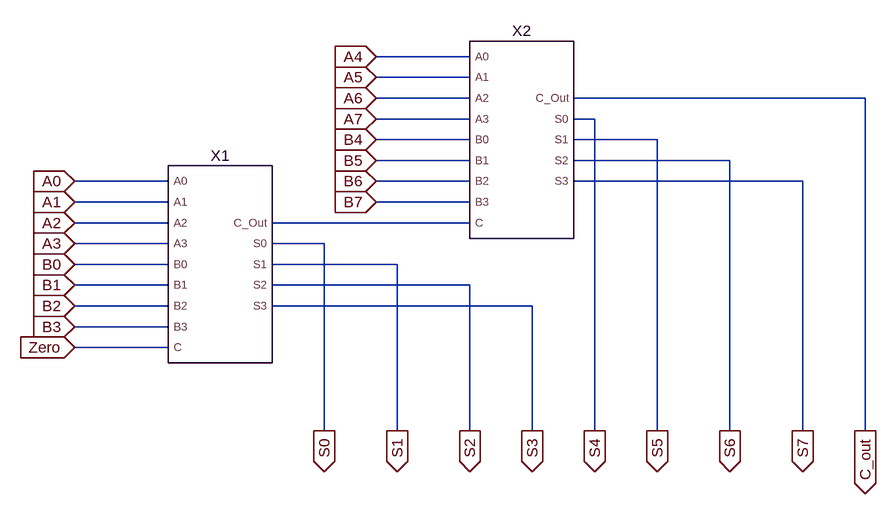
[diagram p0: schematic 8-bit_Adder.asc]
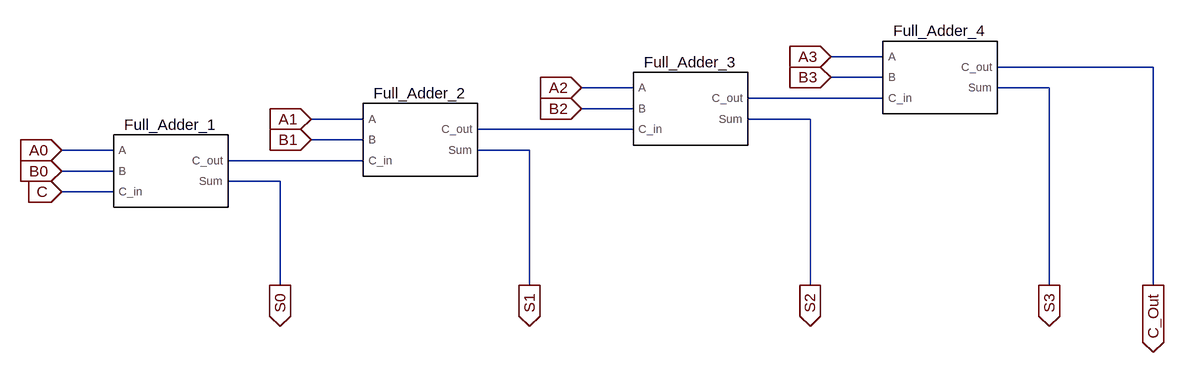
[diagram p1: sub-circuit 4-bit_adder.asc]
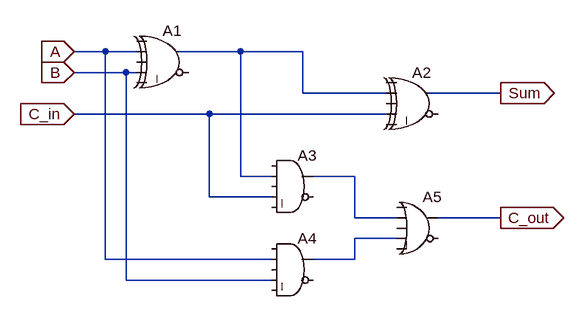
[diagram p2: sub-circuit full_adder.asc]
8-bit_Adder.asc, the LTspice schematic file:
Version 4
SHEET 1 880 720
WIRE 128 16 -16 16
WIRE 128 48 -16 48
WIRE 128 80 -16 80
WIRE 736 80 288 80
WIRE 128 112 -16 112
WIRE 320 112 288 112
WIRE 128 144 -16 144
WIRE 416 144 288 144
WIRE 128 176 -16 176
WIRE 528 176 288 176
WIRE -336 208 -480 208
WIRE 128 208 -16 208
WIRE 640 208 288 208
WIRE -336 240 -480 240
WIRE 128 240 -16 240
WIRE -336 272 -480 272
WIRE 128 272 -176 272
WIRE -336 304 -480 304
WIRE -96 304 -176 304
WIRE -336 336 -480 336
WIRE 16 336 -176 336
WIRE -336 368 -480 368
WIRE 128 368 -176 368
WIRE -336 400 -480 400
WIRE 224 400 -176 400
WIRE -336 432 -480 432
WIRE -336 464 -480 464
WIRE -96 592 -96 304
WIRE 16 592 16 336
WIRE 128 592 128 368
WIRE 224 592 224 400
WIRE 320 592 320 112
WIRE 416 592 416 144
WIRE 528 592 528 176
WIRE 640 592 640 208
WIRE 736 592 736 80
FLAG -480 208 A0
IOPIN -480 208 In
FLAG -480 240 A1
IOPIN -480 240 In
FLAG -480 272 A2
IOPIN -480 272 In
FLAG -480 304 A3
IOPIN -480 304 In
FLAG -16 16 A4
IOPIN -16 16 In
FLAG -16 48 A5
IOPIN -16 48 In
FLAG -16 80 A6
IOPIN -16 80 In
FLAG -16 112 A7
IOPIN -16 112 In
FLAG -16 144 B4
IOPIN -16 144 In
FLAG -16 176 B5
IOPIN -16 176 In
FLAG -16 208 B6
IOPIN -16 208 In
FLAG -16 240 B7
IOPIN -16 240 In
FLAG -480 336 B0
IOPIN -480 336 In
FLAG -480 368 B1
IOPIN -480 368 In
FLAG -480 400 B2
IOPIN -480 400 In
FLAG -480 432 B3
IOPIN -480 432 In
FLAG -480 464 Zero
IOPIN -480 464 In
FLAG -96 592 S0
IOPIN -96 592 Out
FLAG 16 592 S1
IOPIN 16 592 Out
FLAG 128 592 S2
IOPIN 128 592 Out
FLAG 224 592 S3
IOPIN 224 592 Out
FLAG 320 592 S4
IOPIN 320 592 Out
FLAG 416 592 S5
IOPIN 416 592 Out
FLAG 528 592 S6
IOPIN 528 592 Out
FLAG 640 592 S7
IOPIN 640 592 Out
FLAG 736 592 C_out
IOPIN 736 592 Out
SYMBOL 4-bit_Adder 176 144 R0
SYMATTR InstName X2
SYMBOL 4-bit_Adder -288 336 R0
SYMATTR InstName X1

4-bit_adder.asc, the sub-circuit schematic file:
Version 4
SHEET 1 1200 1108
WIRE 672 160 592 160
WIRE 1088 176 848 176
WIRE 672 192 592 192
WIRE 288 208 208 208
WIRE 928 208 848 208
WIRE 672 224 464 224
WIRE 288 240 208 240
WIRE -128 256 -208 256
WIRE 560 256 464 256
WIRE 288 272 48 272
WIRE -128 288 -208 288
WIRE -512 304 -592 304
WIRE 128 304 48 304
WIRE -128 320 -336 320
WIRE -512 336 -592 336
WIRE -256 352 -336 352
WIRE -512 368 -592 368
WIRE -256 512 -256 352
WIRE 128 512 128 304
WIRE 560 512 560 256
WIRE 928 512 928 208
WIRE 1088 512 1088 176
FLAG -592 304 A0
IOPIN -592 304 In
FLAG -208 256 A1
IOPIN -208 256 In
FLAG 208 208 A2
IOPIN 208 208 In
FLAG 592 160 A3
IOPIN 592 160 In
FLAG 592 192 B3
IOPIN 592 192 In
FLAG 208 240 B2
IOPIN 208 240 In
FLAG -208 288 B1
IOPIN -208 288 In
FLAG -592 336 B0
IOPIN -592 336 In
FLAG 128 512 S1
IOPIN 128 512 Out
FLAG 560 512 S2
IOPIN 560 512 Out
FLAG 928 512 S3
IOPIN 928 512 Out
FLAG -256 512 S0
IOPIN -256 512 Out
FLAG 1088 512 C_Out
IOPIN 1088 512 Out
FLAG -592 368 C
IOPIN -592 368 In
SYMBOL Full_Adder -432 336 R0
SYMATTR InstName Full_Adder_1
SYMBOL Full_Adder -48 288 R0
SYMATTR InstName Full_Adder_2
SYMBOL Full_Adder 368 240 R0
SYMATTR InstName Full_Adder_3
SYMBOL Full_Adder 752 192 R0
SYMATTR InstName Full_Adder_4

full_adder.asc, the sub-circuit schematic file:
Version 4
SHEET 1 880 708
WIRE -96 64 -144 64
WIRE -48 64 -96 64
WIRE 112 64 16 64
WIRE 208 64 112 64
WIRE -64 96 -144 96
WIRE -48 96 -64 96
WIRE 208 128 208 64
WIRE 336 128 208 128
WIRE 512 128 400 128
WIRE 64 160 -144 160
WIRE 336 160 64 160
WIRE 112 256 112 64
WIRE 160 256 112 256
WIRE 288 256 224 256
WIRE 64 288 64 160
WIRE 160 288 64 288
WIRE 288 320 288 256
WIRE 352 320 288 320
WIRE 512 320 416 320
WIRE 352 352 288 352
WIRE -96 384 -96 64
WIRE 160 384 -96 384
WIRE 288 384 288 352
WIRE 288 384 224 384
WIRE -64 416 -64 96
WIRE 160 416 -64 416
FLAG -144 64 A
IOPIN -144 64 In
FLAG -144 96 B
IOPIN -144 96 In
FLAG -144 160 C_in
IOPIN -144 160 In
FLAG 512 128 Sum
IOPIN 512 128 Out
FLAG 512 320 C_out
IOPIN 512 320 Out
SYMBOL Digital\\xor 0 16 R0
SYMATTR InstName A1
SYMBOL Digital\\xor 384 80 R0
SYMATTR InstName A2
SYMBOL Digital\\and 192 208 R0
SYMATTR InstName A3
SYMBOL Digital\\and 192 336 R0
SYMATTR InstName A4
SYMBOL Digital\\or 384 272 R0
SYMATTR InstName A5

The netlist it stands for:
* 8-bit_Adder.asc
XX2 A4 A5 A6 A7 B4 B5 B6 B7 N001 C_out S4 S5 S6 S7 4-bit_adder
XX1 A0 A1 A2 A3 B0 B1 B2 B3 Zero N001 S0 S1 S2 S3 4-bit_adder

* block symbol definitions
.subckt 4-bit_adder A0 A1 A2 A3 B0 B1 B2 B3 C C_Out S0 S1 S2 S3
XFull_Adder_1 A0 B0 C N003 S0 full_adder
XFull_Adder_2 A1 B1 N003 N002 S1 full_adder
XFull_Adder_3 A2 B2 N002 N001 S2 full_adder
XFull_Adder_4 A3 B3 N001 C_Out S3 full_adder
.ends 4-bit_adder

.subckt full_adder A B C_in C_out Sum
A1 0 A 0 B 0 0 N001 0 XOR
A2 0 N001 0 C_in 0 0 Sum 0 XOR
A3 0 N001 0 C_in 0 0 N002 0 AND
A4 0 A 0 B 0 0 N003 0 AND
A5 0 N002 0 N003 0 0 C_out 0 OR
.ends full_adder

.backanno
.end